# EAGLE design W5500_Ethernet_shield (EAGLE 6.5.0)

## Sheet 1 of 2
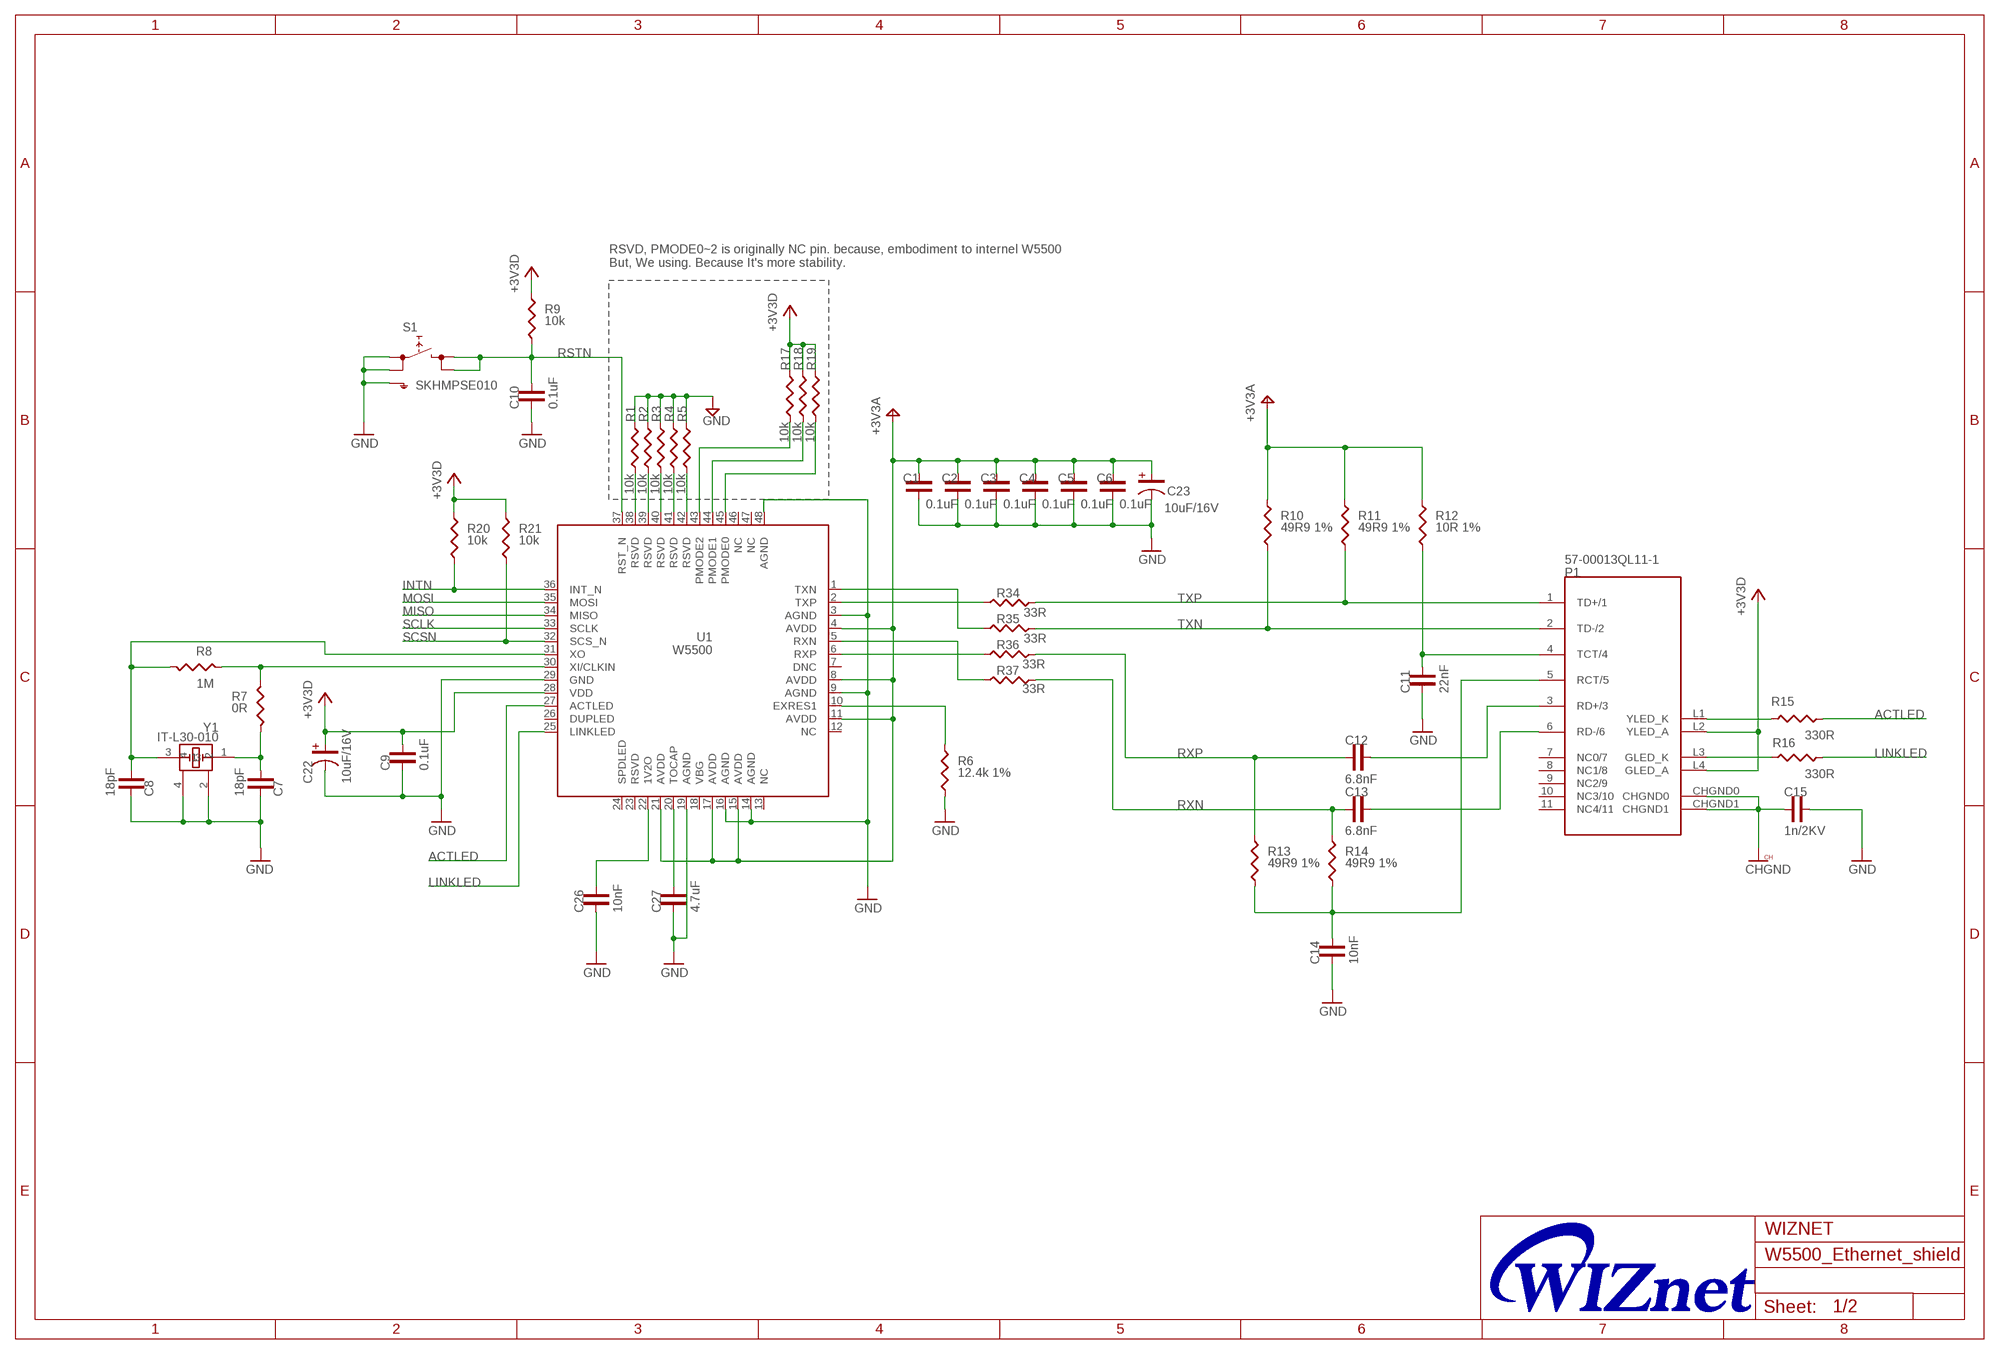
[diagram p0: schematic, sheet 1]

### Parts
C1  0.1uF  C-1608  [C-1608]
C2  0.1uF  C-1608  [C-1608]
C3  0.1uF  C-1608  [C-1608]
C4  0.1uF  C-1608  [C-1608]
C5  0.1uF  C-1608  [C-1608]
C6  0.1uF  C-1608  [C-1608]
C7  18pF  C-1608  [C-1608]
C8  18pF  C-1608  [C-1608]
C9  0.1uF  C-1608  [C-1608]
C10  0.1uF  C-1608  [C-1608]
C11  22nF  C-1608  [C-1608]
C12  6.8nF  C-1608  [C-1608]
C13  6.8nF  C-1608  [C-1608]
C14  10nF  C-1608  [C-1608]
C15  1n/2KV  C-1808  [C-1808]
C22  10uF/16V  C-3216(TANTAL)  [C-3216(TANTAL)]
C23  10uF/16V  C-3216(TANTAL)  [C-3216(TANTAL)]
C26  10nF  C-1608  [C-1608]
C27  4.7uF  C-2012  [C-2012]
P1  57-00013QL11-1  [57-00013QL11-1]
R1  10k  R-1608  [R-1608]
R2  10k  R-1608  [R-1608]
R3  10k  R-1608  [R-1608]
R4  10k  R-1608  [R-1608]
R5  10k  R-1608  [R-1608]
R6  12.4k 1%  R-1608  [R-1608]
R7  0R  R-1608  [R-1608]
R8  1M  R-1608  [R-1608]
R9  10k  R-1608  [R-1608]
R10  49R9 1%  R-1608  [R-1608]
R11  49R9 1%  R-1608  [R-1608]
R12  10R 1%  R-1608  [R-1608]
R13  49R9 1%  R-1608  [R-1608]
R14  49R9 1%  R-1608  [R-1608]
R15  330R  R-1608  [R-1608]
R16  330R  R-1608  [R-1608]
R17  10k  R-1608  [R-1608]
R18  10k  R-1608  [R-1608]
R19  10k  R-1608  [R-1608]
R20  10k  R-1608  [R-1608]
R21  10k  R-1608  [R-1608]
R34  33R  R-1608  [R-1608]
R35  33R  R-1608  [R-1608]
R36  33R  R-1608  [R-1608]
R37  33R  R-1608  [R-1608]
S1  SKHMPSE010  [SKHMPXE010]
U1  W5500  [W5500]
Y1  IT-L30-010  [IT-L30-010]

### Nets
+3V3: C9.2 C22.1 P1.L2(YLED_A) P1.L4(GLED_A) R9.2 R17.2 R18.2 R19.2 R20.2 R21.2 U1.28(VDD) ; supply symbol labelled +3V3D ; also sheet 2
+3V3A: C1.2 C2.2 C3.2 C4.2 C5.2 C6.2 C23.1 R10.2 R11.2 R12.2 U1.4(AVDD) U1.8(AVDD) U1.11(AVDD) U1.15(AVDD) U1.17(AVDD) U1.21(AVDD) ; also sheet 2
ACTLED: R15.1 U1.27(ACTLED)
CHGND: C15.P$1 P1.CHGND0 P1.CHGND1
GND: C1.1 C2.1 C3.1 C4.1 C5.1 C6.1 C7.1 C8.1 C9.1 C10.1 C11.1 C14.1 C15.P$2 C22.2 C23.2 C26.1 C27.P$1 R1.2 R2.2 R3.2 R4.2 R5.2 R6.1 S1.1(1.1) S1.2(1.2) S1.5(SH) U1.3(AGND) U1.9(AGND) U1.14(AGND) U1.16(AGND) U1.19(AGND) U1.29(GND) U1.48(AGND) Y1.2 Y1.4 ; also sheet 2
INTN: R20.1 U1.36(INT_N) ; also sheet 2
LINKLED: R16.1 U1.25(LINKLED)
MISO: U1.34(MISO) ; also sheet 2
MOSI: U1.35(MOSI) ; also sheet 2
N$1: R17.1 U1.43(PMODE2)
N$2: R18.1 U1.44(PMODE1)
N$3: R19.1 U1.45(PMODE0)
N$5: R1.1 U1.38(RSVD)
N$6: R2.1 U1.39(RSVD)
N$7: R3.1 U1.40(RSVD)
N$8: R4.1 U1.41(RSVD)
N$9: R5.1 U1.42(RSVD)
N$11: R7.2 R8.2 U1.30(XI/CLKIN)
N$12: C27.P$2 U1.20(TOCAP)
N$15: C26.2 U1.22(1V2O)
N$16: C12.2 P1.3(RD+/3)
N$17: R6.2 U1.10(EXRES1)
N$18: C13.2 P1.6(RD-/6)
N$19: C14.2 P1.5(RCT/5) R13.1 R14.1
N$20: R36.2 U1.6(RXP)
N$21: C11.2 P1.4(TCT/4) R12.1
N$22: C8.2 R8.1 U1.31(XO) Y1.3
N$24: P1.L3(GLED_K) R16.2
N$25: P1.L1(YLED_K) R15.2
N$26: R37.2 U1.5(RXN)
N$27: R34.2 U1.2(TXP)
N$28: R35.2 U1.1(TXN)
N$29: C7.2 R7.1 Y1.1
RSTN: C10.2 R9.1 S1.3(2.1) S1.4(2.2) U1.37(RST_N) ; also sheet 2
RXN: C13.1 R14.2 R37.1
RXP: C12.1 R13.2 R36.1
SCLK: U1.33(SCLK) ; also sheet 2
SCSN: R21.1 U1.32(SCS_N) ; also sheet 2
TXN: P1.2(TD-/2) R10.1 R35.1
TXP: P1.1(TD+/1) R11.1 R34.1
Unconnected: P1.7(NC0/7) P1.8(NC1/8) P1.9(NC2/9) P1.10(NC3/10) P1.11(NC4/11) U1.7(DNC) U1.12(NC) U1.13(NC) U1.18(VBG) U1.23(RSVD) U1.24(SPDLED) U1.26(DUPLED) U1.46(NC) U1.47(NC)

### Notes on the sheet
- RSVD, PMODE0~2 is originally NC pin. because, embodiment to internel W5500
  But, We using. Because It's more stability.

## Sheet 2 of 2
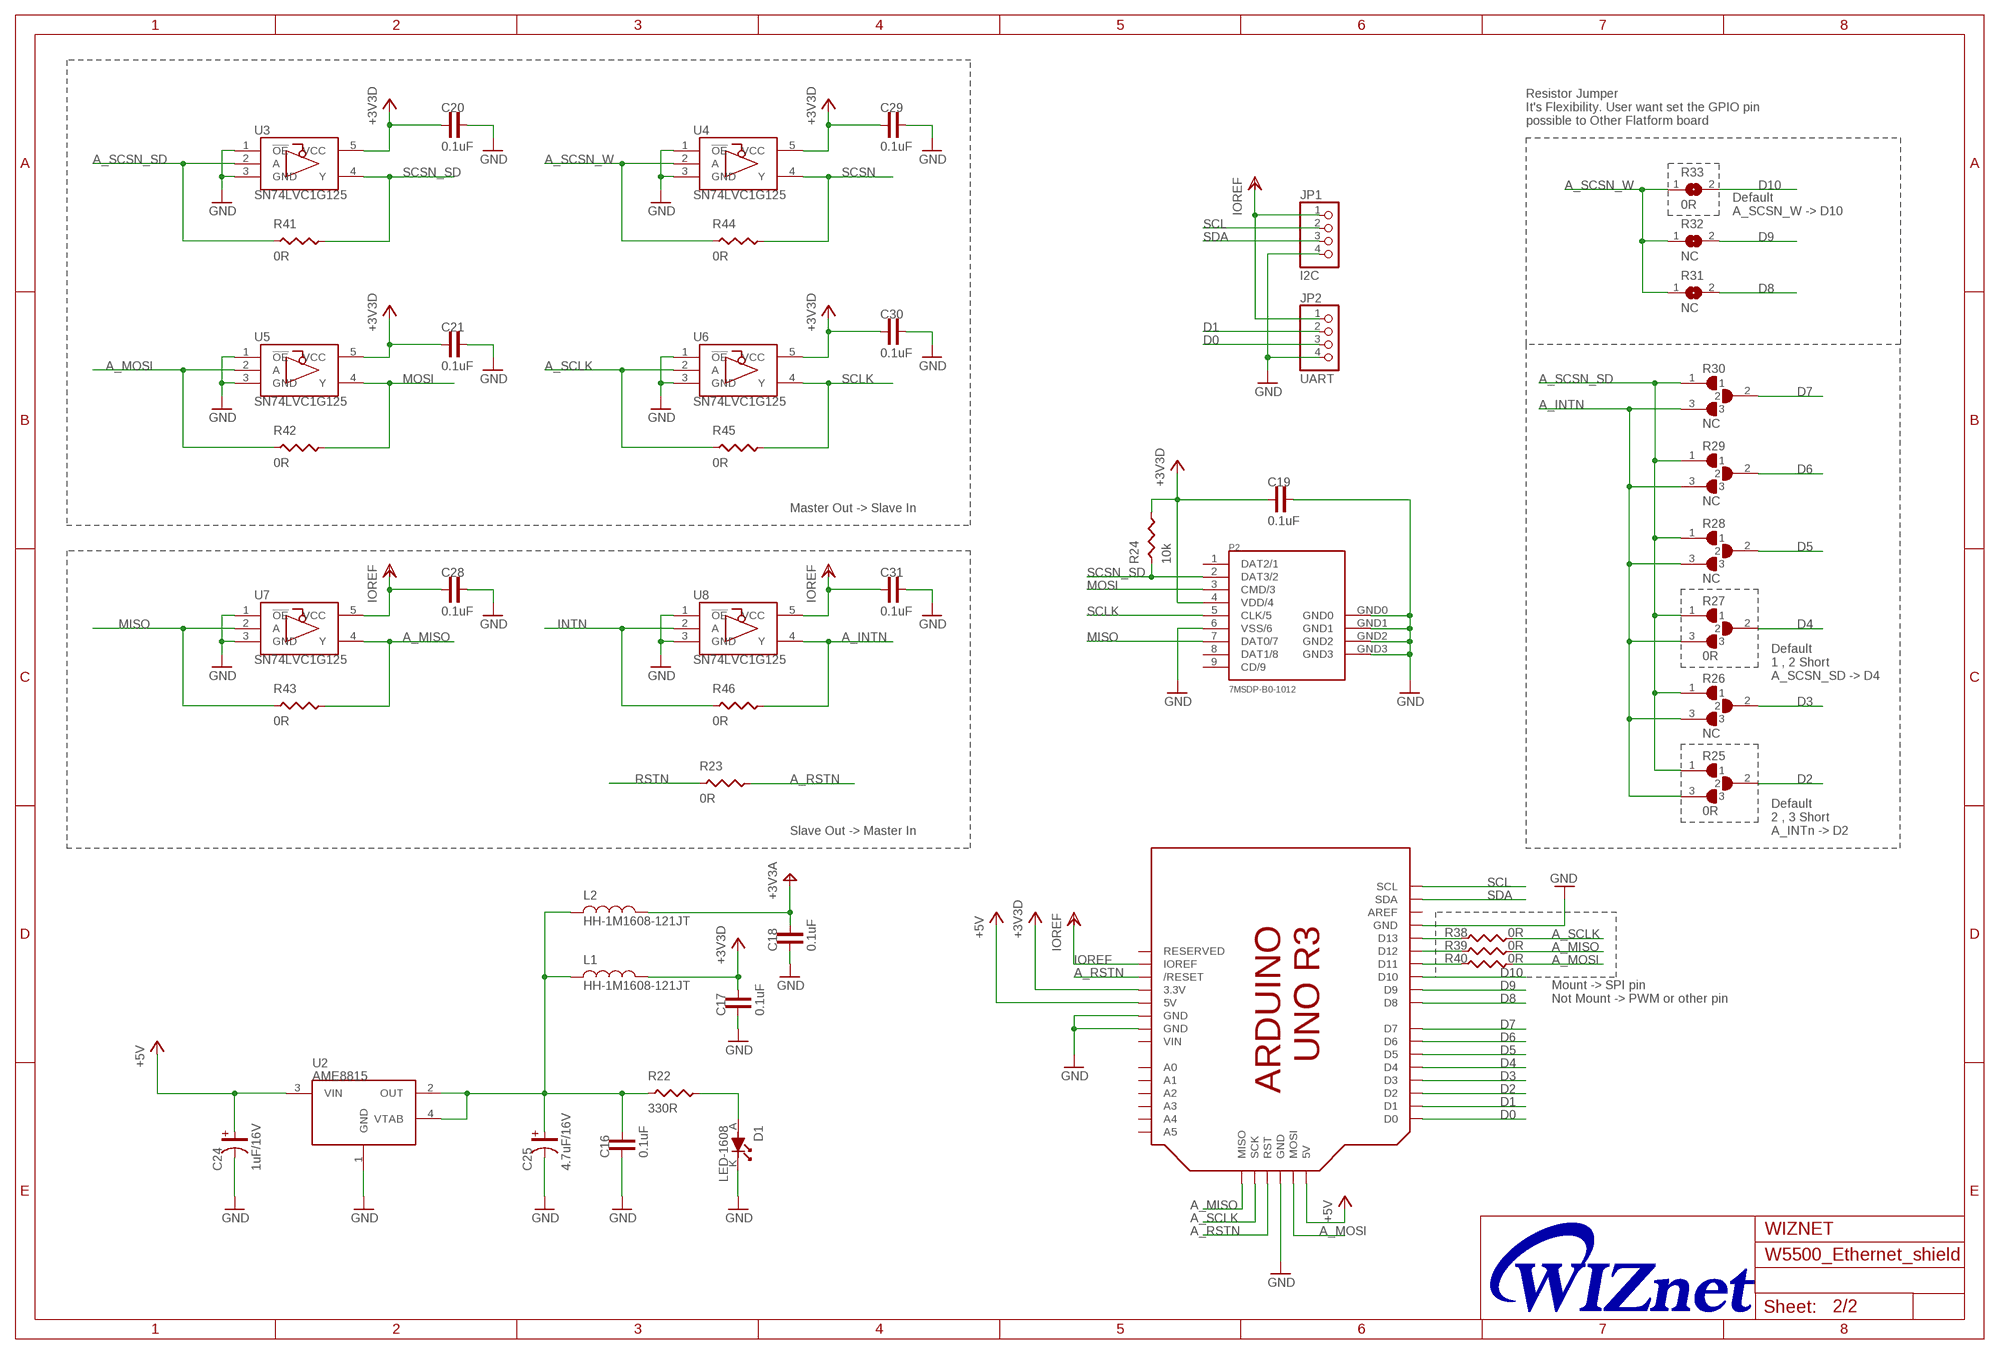
[diagram p1: schematic, sheet 2]

### Parts
C16  0.1uF  C-1608  [C-1608]
C17  0.1uF  C-1608  [C-1608]
C18  0.1uF  C-1608  [C-1608]
C19  0.1uF  C-1608  [C-1608]
C20  0.1uF  C-1608  [C-1608]
C21  0.1uF  C-1608  [C-1608]
C24  1uF/16V  C-3216(TANTAL)  [C-3216(TANTAL)]
C25  4.7uF/16V  C-3216(TANTAL)  [C-3216(TANTAL)]
C28  0.1uF  C-1608  [C-1608]
C29  0.1uF  C-1608  [C-1608]
C30  0.1uF  C-1608  [C-1608]
C31  0.1uF  C-1608  [C-1608]
D1  LED-1608  [LED-1608]
JP1  I2C  PINHD-1X4  [1X04]
JP2  UART  PINHD-1X4  [1X04]
L1  HH-1M1608-121JT  L-1608  [L-1608]
L2  HH-1M1608-121JT  L-1608  [L-1608]
P2  7MSDP-B0-1012  [7MSDP-B0-1012]
R22  330R  R-1608  [R-1608]
R23  0R  R-1608  [R-1608]
R24  10k  R-1608  [R-1608]
R25  0R  RESISTOR_JUMPER_3  [RESISTOR_JUMPER_3]
R26  NC  RESISTOR_JUMPER_3  [RESISTOR_JUMPER_3]
R27  0R  RESISTOR_JUMPER_3  [RESISTOR_JUMPER_3]
R28  NC  RESISTOR_JUMPER_3  [RESISTOR_JUMPER_3]
R29  NC  RESISTOR_JUMPER_3  [RESISTOR_JUMPER_3]
R30  NC  RESISTOR_JUMPER_3  [RESISTOR_JUMPER_3]
R31  NC  SJ_2  [SJW]
R32  NC  SJ_2  [SJW]
R33  0R  SJ_2  [SJW]
R38  0R  R-1608  [R-1608]
R39  0R  R-1608  [R-1608]
R40  0R  R-1608  [R-1608]
R41  0R  R-1608  [R-1608]
R42  0R  R-1608  [R-1608]
R43  0R  R-1608  [R-1608]
R44  0R  R-1608  [R-1608]
R45  0R  R-1608  [R-1608]
R46  0R  R-1608  [R-1608]
U2  AME8815  [AME8815]
U3  SN74LVC1G125  [SN74LVC1G125]
U4  SN74LVC1G125  [SN74LVC1G125]
U5  SN74LVC1G125  [SN74LVC1G125]
U6  SN74LVC1G125  [SN74LVC1G125]
U7  SN74LVC1G125  [SN74LVC1G125]
U8  SN74LVC1G125  [SN74LVC1G125]
U$1  ARDUINO_R3_ICSP  [ARDUINOR3_ICSP]

### Nets
+3V3: C17.2 C19.1 C20.1 C21.1 C29.1 C30.1 L1.P$2 P2.4(VDD/4) R24.2 U3.5(VCC) U4.5(VCC) U5.5(VCC) U6.5(VCC) U$1.3V(3.3V) ; supply symbol labelled +3V3D ; also sheet 1
+3V3A: C18.2 L2.P$2 ; also sheet 1
+5V: C24.1 U2.3(VIN) U$1.5V U$1.5V_ICSP(5V)
A_INTN: R25.3 R26.3 R27.3 R28.3 R29.3 R30.3 R46.2 U8.4(Y)
A_MISO: R39.2 R43.2 U7.4(Y) U$1.MISO
A_MOSI: R40.2 R42.1 U5.2(A) U$1.MOSI
A_RSTN: R23.2 U$1.RESET(/RESET) U$1.RESET_ICSP(RST)
A_SCLK: R38.2 R45.1 U6.2(A) U$1.SCK
A_SCSN_SD: R25.1 R26.1 R27.1 R28.1 R29.1 R30.1 R41.1 U3.2(A)
A_SCSN_W: R31.1 R32.1 R33.1 R44.1 U4.2(A)
D0: JP2.3 U$1.D0
D1: JP2.2 U$1.D1
D2: R25.2 U$1.D2
D3: R26.2 U$1.D3
D4: R27.2 U$1.D4
D5: R28.2 U$1.D5
D6: R29.2 U$1.D6
D7: R30.2 U$1.D7
D8: R31.2 U$1.D8
D9: R32.2 U$1.D9
D10: R33.2 U$1.D10
GND: C16.1 C17.1 C18.1 C19.2 C20.2 C21.2 C24.2 C25.2 C28.2 C29.2 C30.2 C31.2 D1.K JP1.4 JP2.4 P2.6(VSS/6) P2.GND0 P2.GND1 P2.GND2 P2.GND3 U2.1(GND) U3.1(!OE) U3.3(GND) U4.1(!OE) U4.3(GND) U5.1(!OE) U5.3(GND) U6.1(!OE) U6.3(GND) U7.1(!OE) U7.3(GND) U8.1(!OE) U8.3(GND) U$1.GND U$1.GND@1(GND) U$1.GND@2(GND) U$1.GND@3(GND) ; also sheet 1
INTN: R46.1 U8.2(A) ; also sheet 1
IOREF: C28.1 C31.1 JP1.1 JP2.1 U7.5(VCC) U8.5(VCC) U$1.IOREF
MISO: P2.7(DAT0/7) R43.1 U7.2(A) ; also sheet 1
MOSI: P2.3(CMD/3) R42.2 U5.4(Y) ; also sheet 1
N$4: D1.A R22.2
N$10: R38.1 U$1.D13
N$13: C16.2 C25.1 L1.1 L2.1 R22.1 U2.2(OUT) U2.4(VTAB)
N$14: R39.1 U$1.D12
N$30: R40.1 U$1.D11
RSTN: R23.1 ; also sheet 1
SCL: JP1.2 U$1.SCL
SCLK: P2.5(CLK/5) R45.2 U6.4(Y) ; also sheet 1
SCSN: R44.2 U4.4(Y) ; also sheet 1
SCSN_SD: P2.2(DAT3/2) R24.1 R41.2 U3.4(Y)
SDA: JP1.3 U$1.SDA
Unconnected: P2.1(DAT2/1) P2.8(DAT1/8) P2.9(CD/9) U$1.A0 U$1.A1 U$1.A2 U$1.A3 U$1.A4 U$1.A5 U$1.AREF U$1.RESERVED U$1.VIN

### Notes on the sheet
- Resistor Jumper
  It's Flexibility. User want set the GPIO pin
  possible to Other Flatform board
- Default
  A_SCSN_W -> D10
- Master Out -> Slave In
- Default
  1 , 2 Short
  A_SCSN_SD -> D4
- Slave Out -> Master In
- Default
  2 , 3 Short
  A_INTn -> D2
- Mount -> SPI pin
  Not Mount -> PWM or other pin

## Library data of the parts
C1-C14 C16-C21 C26 C28-C31 = CAP:C-1608
C15 = CAP:C-1808
C22-C25 = CAP:C-3216(TANTAL)
C27 = CAP:C-2012
D1 = DIODE:LED-1608
JP1 JP2 = pinhead_boxheader:PINHD-1X4: PIN HEADER
L1 L2 = INDUCTOR:L-1608
P1 = 57-00013QL11-1:57-00013QL11-1
P2 = 7MSDP-B0-1012:7MSDP-B0-1012
R1-R24 R34-R46 = resistor:R-1608
R25-R30 = Resistor_jumper_3:RESISTOR_JUMPER_3
R31-R33 = jumper:SJ_2
S1 = switch:SKHMP*E010: 6.2 X 6.5mm TACT Switch (SMD) Source: http://www3.alps.co.jp/WebObjects/catalog.woa/PDF/E/Switch/Tact/SKHM/SKHM.PDF
U1 = W5500:W5500
U2 = AME8815BEGT330Z:AME8815
U3-U8 = 74LVC1G125DCK:SN74LVC1G125
U$1 = Arduino_ETHERNET_modify:ARDUINO_R3_ICSP
Y1 = IT-L30-010:IT-L30-010

## Board
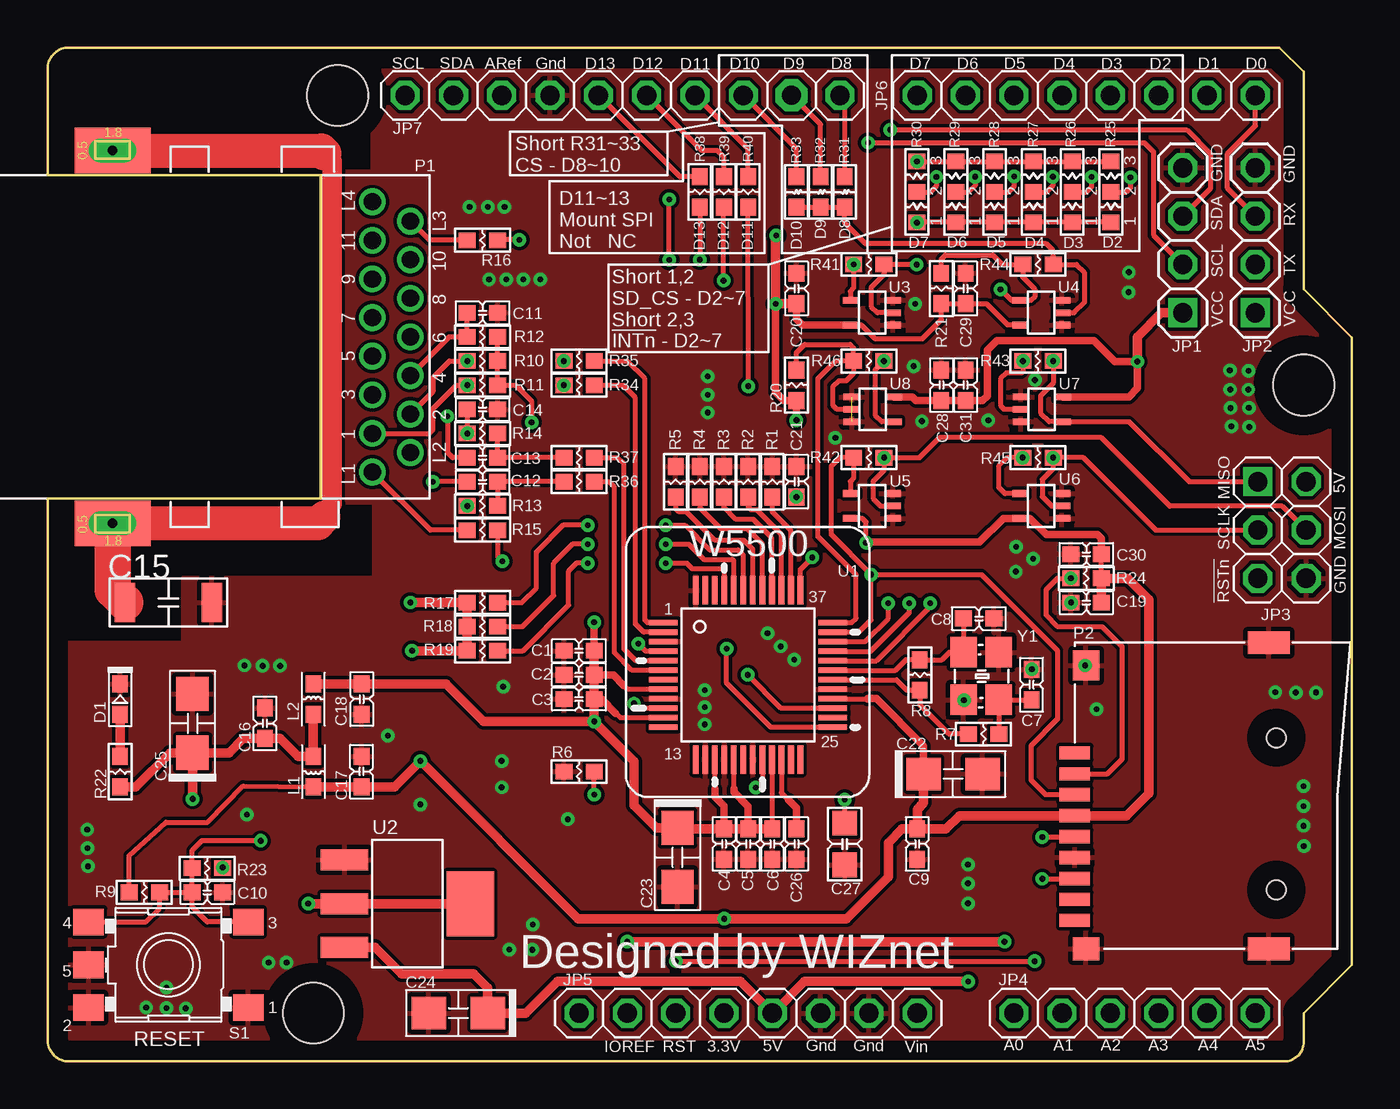
[diagram p2: board, top side]
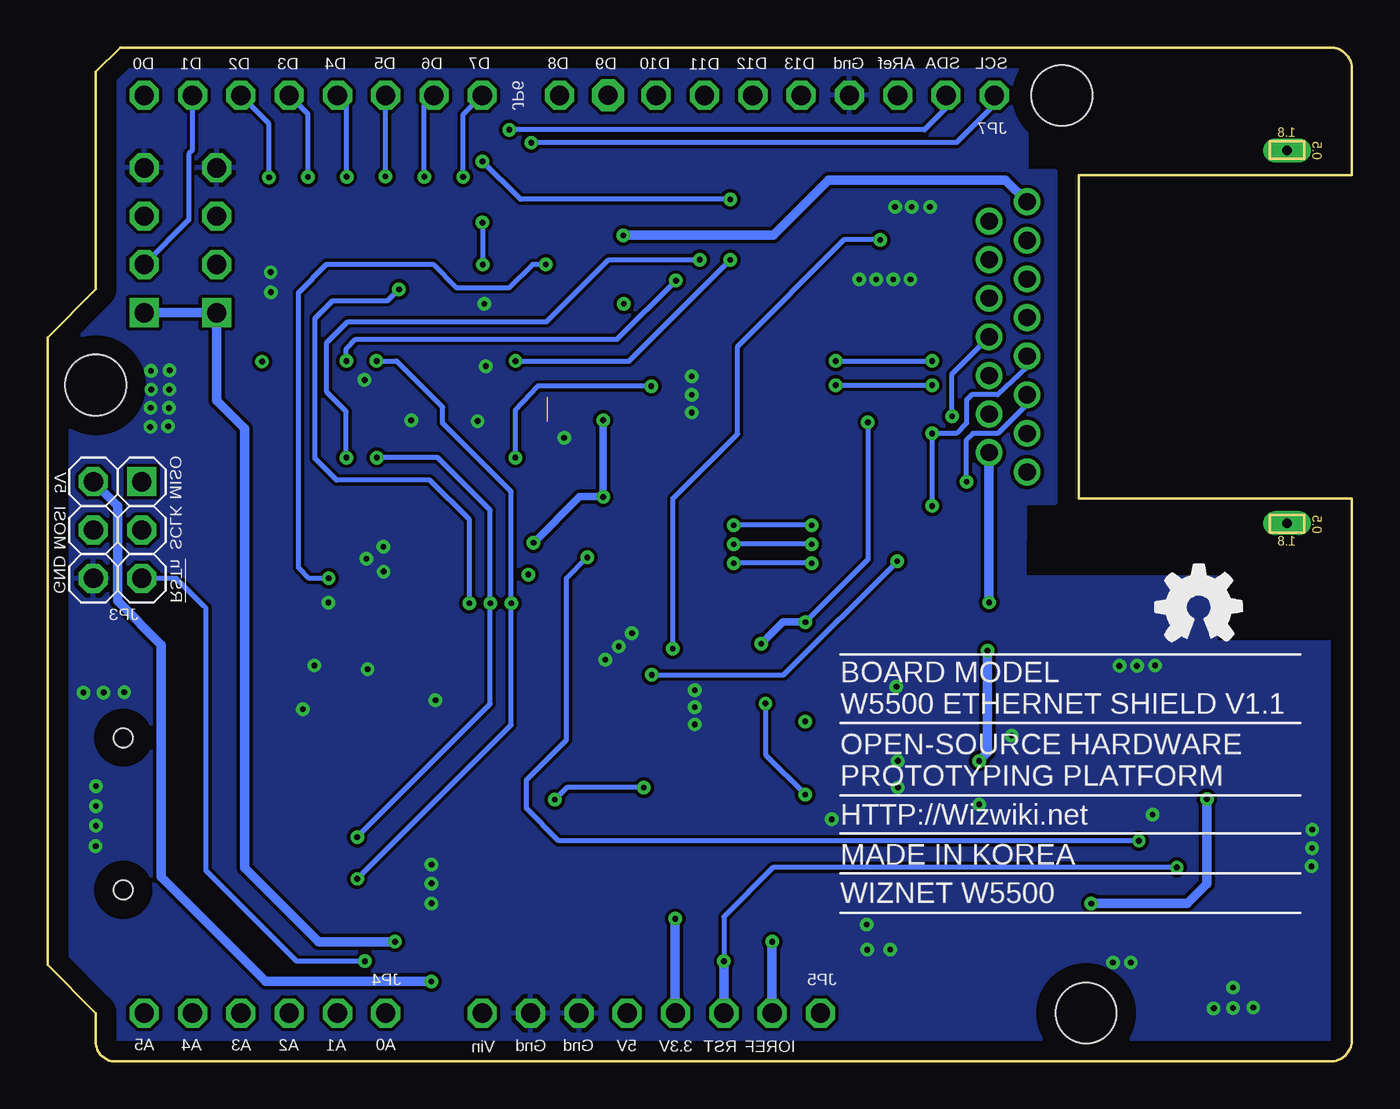
[diagram p3: board, bottom side, seen from below]

Size 68.59 x 53.31 mm. Coordinates in mm from the lower left corner, seen from the top.
Copper layers (1*16): Top 0.035mm / dielectric 1.5mm / Bottom 0.035mm
Design rules "default *": minimum track width 10mil, minimum drill 0.3mm, track to track 0.18mm, track to pad 0.18mm, pad to pad 0.18mm, via to via 0.18mm, smd to smd 0.18mm, copper to edge 40mil, drill to drill 8mil, minimum pad ring 10mil, minimum via ring 8mil, stop-mask expansion 0mil, vias tented up to drill 40mil, thermal gap 10mil

### Footprints (pad centres in the part's own frame; a part is rotated, then mirrored left to right if it is on the bottom)
C-1608 = smd 0.89 x 0.82: 1 0.8,0; 2 -0.8,0
C-1808 = smd 1.1 x 2.05: P$1 -2.285,0; P$2 2.285,0
C-3216(TANTAL) = smd 1.8 x 1.7: 1 1.55,0; 2 -1.55,0
C-2012 = smd 1.3 x 1.3: P$1 -1.1,0; P$2 1.1,0
LED-1608 = smd 0.89 x 0.82: A -0.8,0; K 0.8,0
1X04 = drill 1.016 square: 1 -3.81,0 | drill 1.016 octagon: 2 -1.27,0; 3 1.27,0; 4 3.81,0
L-1608 = smd 0.89 x 0.82: 1 -0.8,0; P$2 0.8,0
57-00013QL11-1 = drill 0.9: 1 5.075,13.66; 2 4.06,15.66; 3 3.045,13.66; 4 2.03,15.66; 5 1.015,13.66; 6 0,15.66; 7 -1.015,13.66; 8 -2.03,15.66; 9 -3.045,13.66; 10 -4.06,15.66; 11 -5.075,13.66; L1 7.105,13.66; L2 6.09,15.66; L3 -6.09,15.66; L4 -7.105,13.66 | smd 2.4 x 4: CHGND0 -9.8,0; CHGND1 9.8,0 | drill 0.5 pad 1.27 long: P$1 -9.8,0; P$2 9.8,0
7MSDP-B0-1012 = smd 0.7 x 1.6: 1 2.25,10.2; 2 1.15,10.2; 3 0.05,10.2; 4 -1.05,10.2; 5 -2.15,10.2; 6 -3.25,10.2; 7 -4.35,10.2; 8 -5.45,10.2; 9 -6.55,10.2 | smd 1.2 x 2.2: GND0 8.05,0; GND1 -8.05,0 | smd 1.6 x 1.4: GND2 6.85,9.6 | smd 1.2 x 1.4: GND3 -8.05,9.6 | hole 1: 3.05,-0.4; -4.95,-0.4
R-1608 = smd 0.89 x 0.82: 1 -0.8,0; 2 0.8,0
RESISTOR_JUMPER_3 = smd 0.82 x 0.89: 1 -1.6,0; 2 0,0; 3 1.6,0
SJW = smd 0.89 x 0.82: 1 -0.8,0; 2 0.8,0
SKHMPXE010 = smd 1.6 x 1.4: 1 -4.2,2.25; 2 4.2,2.25; 3 -4.2,-2.25; 4 4.2,-2.25; 5 4.2,0
W5500 = smd 1.5 x 0.3: 1 -4.45,2.75; 2 -4.45,2.25; 3 -4.45,1.75; 4 -4.45,1.25; 5 -4.45,0.75; 6 -4.45,0.25; 7 -4.45,-0.25; 8 -4.45,-0.75; 9 -4.45,-1.25; 10 -4.45,-1.75; 11 -4.45,-2.25; 12 -4.45,-2.75; 25 4.45,-2.75; 26 4.45,-2.25; 27 4.45,-1.75; 28 4.45,-1.25; 29 4.45,-0.75; 30 4.45,-0.25; 31 4.45,0.25; 32 4.45,0.75; 33 4.45,1.25; 34 4.45,1.75; 35 4.45,2.25; 36 4.45,2.75 | smd 0.3 x 1.5: 13 -2.75,-4.45; 14 -2.25,-4.45; 15 -1.75,-4.45; 16 -1.25,-4.45; 17 -0.75,-4.45; 18 -0.25,-4.45; 19 0.25,-4.45; 20 0.75,-4.45; 21 1.25,-4.45; 22 1.75,-4.45; 23 2.25,-4.45; 24 2.75,-4.45; 37 2.75,4.45; 38 2.25,4.45; 39 1.75,4.45; 40 1.25,4.45; 41 0.75,4.45; 42 0.25,4.45; 43 -0.25,4.45; 44 -0.75,4.45; 45 -1.25,4.45; 46 -1.75,4.45; 47 -2.25,4.45; 48 -2.75,4.45
AME8815 = smd 1.1 x 2.5: 1 -2.3,-3.175; 2 0,-3.175; 3 2.3,-3.175 | smd 3.4 x 2.5: 4 0,3.435
SN74LVC1G125 = smd 0.35 x 0.85: 1 -0.65,0; 2 0,0; 3 0.65,0; 4 0.65,2.2; 5 -0.65,2.2
ARDUINOR3_ICSP = drill 1.016 octagon: 3V 35.56,2.54; 5V 38.1,2.54; 5V_ICSP 66.167,30.48; A0 50.8,2.54; A1 53.34,2.54; A2 55.88,2.54; A3 58.42,2.54; A4 60.96,2.54; A5 63.5,2.54; AREF 23.876,50.8; D0 63.5,50.8; D1 60.96,50.8; D2 58.42,50.8; D3 55.88,50.8; D4 53.34,50.8; D5 50.8,50.8; D6 48.26,50.8; D7 45.72,50.8; D8 41.656,50.8; D10 36.576,50.8; D11 34.036,50.8; D12 31.496,50.8; D13 28.956,50.8; GND 26.416,50.8; GND@1 43.18,2.54; GND@2 40.64,2.54; GND@3 66.167,25.4; IOREF 30.48,2.54; MOSI 66.167,27.94; RESERVED 27.94,2.54; RESET 33.02,2.54; RESET_ICSP 63.627,25.4; SCK 63.627,27.94; SCL 18.796,50.8; SDA 21.336,50.8; VIN 45.72,2.54 | drill 1 pad 1.676 octagon: D9 39.116,50.8 | drill 1.016 square: MISO 63.627,30.48 | hole 3.2: 66.04,35.56; 15.24,50.8; 13.97,2.54
IT-L30-010 = smd 1.6 x 1.4: 1 -1.25,0; 2 1.25,0; 3 1.25,1.85; 4 -1.25,1.85

### Placement (x,y rotation side)
C1  27.95,21.59 180 top
C2  27.95,20.32 180 top
C3  27.95,19.05 180 top
C4  35.57,11.43 270 top
C5  36.84,11.43 270 top
C6  38.11,11.43 270 top
C7  51.74,19.81 90 top
C8  48.96,23.29 0 top
C9  45.73,11.43 270 top
C10  8.4,8.89 0 top
C11  22.87,39.37 0 top
C12  22.87,30.48 0 top
C13  22.87,31.75 0 top
C14  22.87,34.29 0 top
C15  6.36,24.13 0 top
C16  11.44,17.78 90 top
C17  16.52,15.24 90 top
C18  16.52,19.05 270 top
C19  54.62,24.13 0 top
C20  39.38,40.64 270 top
C21  39.38,30.48 270 top
C22  47.62,15.11 180 top
C23  33.13,10.73 90 top
C24  21.6,2.54 0 top
C25  7.63,17.78 270 top
C26  39.38,11.43 270 top
C27  41.92,11.43 90 top
C28  47,35.56 270 top
C29  48.27,40.64 270 top
C30  54.62,26.67 0 top
C31  48.27,35.56 270 top
D1  3.82,19.05 90 top
JP1  59.7,43.18 90 top
JP2  63.51,43.18 90 top
L1  13.98,15.24 270 top
L2  13.98,19.05 90 top
P1  3.42,38.1 270 top
P2  64.21,13.97 90 top
R1  38.11,30.48 90 top
R2  36.84,30.48 90 top
R3  35.57,30.48 90 top
R4  34.3,30.48 90 top
R5  33.03,30.48 90 top
R6  27.95,15.24 0 top
R7  49.21,17.21 180 top
R8  45.86,20.32 270 top
R9  5.09,8.89 180 top
R10  22.87,36.83 0 top
R11  22.87,35.56 0 top
R12  22.87,38.1 0 top
R13  22.87,29.21 0 top
R14  22.87,33.02 0 top
R15  22.87,27.94 180 top
R16  22.87,43.18 180 top
R17  22.87,24.13 180 top
R18  22.87,22.86 180 top
R19  22.87,21.59 180 top
R20  39.38,35.56 270 top
R21  47,40.64 270 top
R22  3.82,15.24 90 top
R23  8.4,10.16 0 top
R24  54.62,25.4 0 top
R25  55.92,45.72 90 top
R26  53.88,45.72 90 top
R27  51.84,45.72 90 top
R28  49.8,45.72 90 top
R29  47.76,45.72 90 top
R30  45.72,45.72 90 top
R31  41.92,45.72 90 top
R32  40.65,45.72 90 top
R33  39.38,45.72 90 top
R34  27.95,35.56 0 top
R35  27.95,36.83 0 top
R36  27.95,30.48 0 top
R37  27.95,31.75 0 top
R38  34.3,45.72 270 top
R39  35.57,45.72 270 top
R40  36.84,45.72 270 top
R41  43.19,41.91 180 top
R42  43.19,31.75 180 top
R43  52.08,36.83 0 top
R44  52.08,41.91 180 top
R45  52.08,31.75 180 top
R46  43.19,36.83 0 top
S1  6.36,5.08 180 top
U1  36.84,20.32 0 top
U2  18.79,8.29 270 top
U3  44.46,39.37 90 top
U4  53.35,39.37 90 top
U5  44.46,29.21 90 top
U6  53.35,29.21 90 top
U7  51.18,34.29 270 top
U8  42.29,34.29 270 top
U$1  0.01,0 0 top
U$4  [OSHP-LOGO]  11.11,21.5 0 bottom
U$7  [IOPIOT_LOGO_3]  27.21,21.8 0 bottom
Y1  50.01,20.26 90 top

### Tracks (layer width: path | path; a pad name or v marks a point on that pad's centre or on a via)
+3V3  (via drill 0.3)
  Top 0.254: R9.2 4.29,10.83 6.22,12.57 8.42,12.57 10.29,14.48 L1.P$2 | R24.2 C30.1 | v43.04,27.27 43.04,28.37 42.85,28.56 U5.5 | U3.5 42.79,38.72 43.51,38 46.01,38 47.01,39 R21.2 C29.1 49.37,39.84 50.49,38.72 U4.5 | U1.28 43.12,19.07
  Top 0.406: C30.1 55.42,27.49 55.21,27.7 52.51,27.7 51.65,28.56 U6.5 50.27,28.56 49.01,27.3 43.07,27.3 v43.04,27.27 | U3.5 39.69,38.72 39.38,39.03 C20.1 | v38.29,39.84 38.29,35.19 38.72,34.76 R20.2 v39.38,33.72 | C22.1 46.07,16.6 43.59,19.08 43.13,19.08 43.12,19.07
  Top 0.508: L1.P$2 C17.2 18.25,14.44 v19.61,15.8 27.91,7.5 v35.59,7.5 42.01,7.5 44.21,9.7 44.21,11.5 44.94,12.23 C9.2 | v19.07,24.13 R17.2 R18.2 R19.2 v19.16,21.59 | C9.2 47.25,12.23 47.94,12.92 P2.4 56.73,12.92 57.91,14.1 57.91,24.3 56.81,25.4 R24.2 C19.1 | C22.1 46.07,13.6 45.73,13.26 C9.2 | v38.32,43.44 38.29,43.41 v38.29,39.84 C20.1
  Bottom 0.406: v43.04,27.27 40.61,29.7 39.4,29.7 C21.1 v39.38,33.72
  Bottom 0.508: v38.32,43.44 30.42,43.44 27.52,46.34 18.21,46.34 P1.L4 | U$1.3V 35.59,2.54 v35.59,7.5 | v19.07,24.13 v19.08,24.14 P1.L2 | v19.61,15.8 19.16,16.24 v19.16,21.59
  other vias: 39.38,29.68
+3V3A  (via drill 0.3)
  Top 0.254: C1.2 | U1.4 31.46,21.57 v31.06,21.97 | U1.21 38.09,12.25 C6.2 | R12.2 R10.2 R11.2 24.62,35.56 25.45,34.73 v25.45,33.62 | 35.09,14.34 U1.15 | 36.09,14.33 U1.17 | U1.8 30.5,19.57 30.29,19.78 | U1.11 30.12,18.07 29.88,18.31
  Top 0.406: v28.74,23.1 C1.2 | C2.2 29.75,20.32 30.29,19.78 | C5.2 36.84,13.42 36.09,14.17 36.09,14.33 | 35.54,12.2 C4.2 35.57,13.43 35.09,13.91 35.09,14.34 | v25.45,33.62 v25.45,33.61 | C3.2 29.14,19.05 29.88,18.31
  Top 0.508: L2.P$2 C18.2 20.96,19.85 22.93,17.88 v28.74,17.88 | v28.74,17.88 30.84,15.78 30.84,13.46 32.01,12.28 C23.1 33.18,12.23 C4.2 C5.2 C6.2 | v28.74,17.88 v28.75,17.88 C3.2 C2.2 C1.2
  Bottom 0.254: v28.74,23.1 25.45,26.39 v25.45,33.61
  Bottom 0.406: v28.74,23.1 29.93,23.1 v31.06,21.97
+5V  (via drill 0.3)
  Top 0.508: U2.3 17.22,5.99 18.61,4.6 22.41,4.6 23.15,3.86 C24.1 25.15,2.54 26.81,4.2 36.45,4.2 U$1.5V 38.15,2.54 39.81,4.2 v48.41,4.2
  Bottom 0.508: v48.41,4.2 57.11,4.2 62.61,9.7 62.61,21.9 64.91,24.2 64.91,29.21 U$1.5V_ICSP
A_INTN  (via drill 0.3)
  Top 0.254: R30.3 R29.3 R28.3 R27.3 R26.3 R25.3 | v43.98,36.83 R46.2 43.52,36.36 43.52,33.99 43.87,33.64 U8.4 44.31,33.64 | v32.69,42.15 v32.69,45.33
  Bottom 0.254: v43.98,36.83 38.01,36.83 v32.69,42.15 | v32.69,45.33 43.73,45.33 R30.3
  other vias: 45.72,47.32
A_MISO  (via drill 0.3)
  Top 0.254: v35.55,41.06 35.55,44.9 R39.2 | U$1.MISO 60.03,30.48 56.87,33.64 U7.4 52.67,33.64 52.21,34.1 52.21,35 52.88,35.67 R43.2
  Bottom 0.254: R43.2 52.88,37.47 52.38,37.97 38.64,37.97 v35.55,41.06
  other vias: 52.88,36.83
A_MOSI  (via drill 0.3)
  Top 0.254: U5.2 43.81,29.2 43.41,29.6 43.41,30.5 43.99,31.08 R42.1 45.86,31.75 46.91,32.8 55.41,32.8 59.01,29.2 64.91,29.2 U$1.MOSI | v36.85,35.51 R40.2
  Bottom 0.254: R42.1 43.99,34.24 42.8,35.52 v36.85,35.51
  other vias: 43.99,31.75
A_RSTN  (via drill 0.3)
  Top 0.254: v33.02,5.27 v51.91,5.27
  Top 0.508: R23.2 v9.21,10.2
  Bottom 0.254: v9.21,10.2 30.44,10.2 33.03,7.62 v33.03,5.27 v33.02,5.27 v33.03,5.26 | U$1.RESET_ICSP 61.82,25.4 60.38,23.96 60.26,23.84 60.26,10.03 55.49,5.27 v51.91,5.27
  Bottom 0.508: U$1.RESET v33.02,5.27
A_SCLK  (via drill 0.3)
  Top 0.254: U6.2 52.81,29.2 52.31,29.7 52.31,30.6 52.88,31.17 R45.1 54.46,31.75 58.27,27.94 U$1.SCK | R38.2 v34.3,42.16
  Bottom 0.254: v34.3,42.16 39.09,42.16 42.35,38.9 52.81,38.9 53.91,37.8 53.91,35.2 52.88,34.17 R45.1
  other vias: 52.88,31.75
A_SCSN_SD  (via drill 0.3)
  Top 0.254: R25.1 R26.1 R27.1 R28.1 R29.1 R30.1 v45.72,44.11 | v45.71,41.9 R41.1 43.99,41.38 43.31,40.7 43.31,39.7 43.64,39.37 U3.2
  Bottom 0.254: v45.72,44.11 v45.71,41.9
A_SCSN_W
  Top 0.254: R33.1 R32.1 R31.1 41.91,44.1 43.01,43 52.51,43 52.88,42.63 R44.1 54.1,41.91 54.51,41.5 54.51,39.9 53.98,39.37 U4.2
ACTLED  (via drill 0.3)
  Top 0.254: R15.1 23.67,26.54 v23.91,26.3 | U1.27 38.58,18.57 v36.82,20.32
  Bottom 0.254: v36.82,20.32 29.88,20.32 v23.91,26.3
CHGND
  Top 1.016: 14.57,47.74 14.98,47.33 14.98,46.87 14.97,46.86 14.97,29.31 14.57,28.91 14.57,28.64
  Top 1.676: 14.23,28.3 14.57,28.64
  Top 1.778: P1.CHGND1 14.23,28.3 | P1.CHGND0 14.41,47.9 14.57,47.74
  Top 1.93: P1.CHGND1 3.42,24.79 C15.P$1
D0
  Top 0.254: JP2.3 62.01,45.95 62.01,47.7 63.51,49.2 U$1.D0
D1
  Bottom 0.254: JP2.2 61.16,44.26 61.16,47.73 60.97,47.92 U$1.D1
D2  (via drill 0.3)
  Top 0.254: R25.2 56.72,45.72 56.94,45.94 v56.94,46.49
  Bottom 0.254: v56.94,46.49 56.94,49.31 U$1.D2
D3  (via drill 0.3)
  Top 0.254: R26.2 54.63,45.72 54.9,45.99 v54.9,46.51
  Bottom 0.254: v54.9,46.51 54.9,49.81 U$1.D3
D4  (via drill 0.3)
  Top 0.254: R27.2 52.53,45.72 52.86,46.05 v52.86,46.52
  Bottom 0.254: v52.86,46.52 52.86,50.31 U$1.D4
D5  (via drill 0.3)
  Top 0.254: R28.2 50.53,45.72 50.82,46.01 v50.82,46.53
  Bottom 0.254: v50.82,46.53 50.81,46.61 U$1.D5
D6  (via drill 0.3)
  Top 0.254: R29.2 48.43,45.72 48.78,46.06 v48.78,46.52
  Bottom 0.254: v48.78,46.52 48.78,50.29 U$1.D6
D7  (via drill 0.3)
  Top 0.254: R30.2 46.43,45.72 46.74,46.03 v46.74,46.51
  Bottom 0.254: v46.74,46.51 46.74,49.79 U$1.D7
D8
  Top 0.254: R31.2 41.92,50.55 U$1.D8
D9
  Top 0.254: R32.2 40.65,49.28 U$1.D9
D10
  Top 0.254: R33.2 39.38,48.01 U$1.D10
GND  (via drill 0.3)  (1 unrouted)
  other vias: 53.82,24.13 51.76,20.62 48.19,18.99 50.92,25.76 51.83,26.44 50.93,27.07 49.47,33.71 45.55,36.56 54.56,20.82 55.16,18.52 37.86,22.52 39.26,21.12 38.56,21.82 34.56,18.62 34.56,17.72 34.56,19.52 23.22,41.13 24.12,41.13 25.02,41.13 25.92,41.13 45.62,39.83 41.43,32.8 51.92,35.83 6.26,2.81 7.27,2.79 6.26,3.88 5.19,2.83 17.89,17.13 19.61,13.51 10.48,12.97 11.63,5.19 12.57,5.19 25.5,5.87 25.52,7.2 24.28,5.88 2.13,10.26 2.11,11.22 2.09,12.19 10.35,20.82 11.31,20.8 12.23,20.8 34.72,34.12 34.72,35.06 34.72,36.02 22.19,44.93 23.15,44.93 24.03,44.93 45.98,33.67 56.86,41.5 62.25,33.4 62.2,34.36 63.19,33.36 63.17,34.37 63.14,35.33 62.19,35.33 62.17,36.34 63.16,36.31 56.85,40.45 48.4,10.35 48.4,9.36 48.4,8.31 66.04,14.48 66.05,13.42 66.05,12.39 66.06,11.32 64.56,19.42 65.64,19.4 66.7,19.4 23.88,14.41 23.88,15.8 27.36,12.73 23.96,19.71
  pour Bottom: -5.49,22 7.17,22 7.15,25.46 17.22,25.42 17.21,29.4 15.61,29.4 15.61,46.8 17.11,46.8 17.11,57.8 68.61,57.8 68.61,0 -5.49,0
  pour Top: -2.49,22 7.16,22 7.15,25.44 17.21,25.41 17.21,29.4 15.61,29.4 15.61,46.8 17.11,46.8 17.11,55.6 68.61,55.6 68.61,0 -2.49,0
INTN
  Top 0.254: U1.36 42.28,23.07 42.51,23.3 42.51,25.6 40.51,27.6 40.51,35.9 41.44,36.83 R46.1 | U8.2 41.52,34.29 41.31,34.5 41.31,35.5 41.61,35.8 42.01,35.8 42.39,36.18 R46.1 | R20.1 39.38,37.27 39.81,37.7 42.21,37.7 42.39,37.52 R46.1
IOREF  (via drill 0.3)
  Top 0.406: 48.31,34.8 C31.1 | C31.1 C28.1 45.65,34.76 45.47,34.94 U8.5 | C31.1 49.17,34.76 49.41,35 49.41,37.4 49.91,37.9 55.01,37.9 56.11,36.8 v57.31,36.8 57.31,35.4 56.85,34.94 U7.5
  Top 0.508: v30.48,6.29 v50.32,6.29 | JP1.1 58.58,39.37 57.31,38.1 v57.31,36.8
  Bottom 0.508: JP2.1 JP1.1 59.7,34.75 58.22,33.27 58.22,10.17 54.34,6.29 v50.32,6.29 | U$1.IOREF v30.49,6.29 v30.48,6.29
LINKLED  (via drill 0.3)
  Top 0.254: U1.25 38.04,17.57 35.71,19.9 v35.71,21.7 | v24.81,43.2 23.69,43.2 R16.1
  Bottom 0.254: v35.71,21.7 35.71,29.6 32.31,33 32.31,37.6 26.71,43.2 v24.81,43.2
MISO  (via drill 0.3)
  Top 0.254: v52.31,9.6 53.99,9.6 P2.7 | U1.34 42.98,22.07 44.21,23.3 v44.21,24.1 | v51.29,36.83 R43.1 51.28,36.27 51.21,36.2 50.41,36.2 50.11,35.9 50.11,34.5 50.32,34.29 U7.2
  Bottom 0.254: v52.31,9.6 44.21,17.7 v44.21,24.1 44.21,29.96 47.81,33.56 47.81,34.4 50.24,36.83 v51.29,36.83
MOSI  (via drill 0.3)
  Top 0.254: U1.35 42.68,22.57 43.31,23.2 v43.31,25.6 | U5.4 42.21,29.91 42.21,30.5 42.39,30.68 R42.2 41.66,31.75 41.21,31.3 41.21,27.7 v43.31,25.6 | P2.3 52.49,14.02 51.71,14.8 51.71,16.6 53.11,18 53.11,21.6 49.11,25.6 v43.31,25.6
N$1  (via drill 0.3)
  Top 0.254: U1.43 36.59,26.62 36.31,26.9 34.81,26.9 33.51,28.2 v32.51,28.2 | R17.1 24.94,24.13 25.71,24.9 25.71,26.8 27.11,28.2 v28.41,28.2
  Bottom 0.254: v28.41,28.2 v32.51,28.2
N$2  (via drill 0.3)
  Top 0.254: U1.44 36.09,26.32 36.01,26.4 34.51,26.4 33.71,27.2 v32.51,27.2 | R18.1 24.97,22.86 26.61,24.5 26.61,26.2 27.61,27.2 v28.41,27.2
  Bottom 0.254: v28.41,27.2 v32.51,27.2
N$3  (via drill 0.3)
  Top 0.254: U1.45 35.59,25.82 35.51,25.9 33.91,25.9 33.61,26.2 v32.51,26.2 | R19.1 25,21.59 27.41,24 27.41,25.8 27.81,26.2 v28.41,26.2
  Bottom 0.254: v28.41,26.2 v32.51,26.2
N$4
  Top 0.508: R22.2 D1.A
N$5
  Top 0.254: U1.38 39.09,27.92 38.11,28.9 R1.1
N$6
  Top 0.254: U1.39 38.59,27.72 37.31,29 37.01,29 36.84,29.17 R2.1
N$7
  Top 0.254: U1.40 38.09,27.52 37.11,28.5 36.21,28.5 35.57,29.14 R3.1
N$8
  Top 0.254: U1.41 37.59,27.22 36.81,28 35.41,28 34.3,29.11 R4.1
N$9
  Top 0.254: U1.42 37.09,26.92 36.61,27.4 35.11,27.4 33.61,28.9 33.21,28.9 33.03,29.08 R5.1
N$10
  Top 0.254: R38.1 33.24,46.52 U$1.D13
N$11
  Top 0.254: U1.30 44.64,20.07 45.19,19.52 R8.2 45.86,18.75 47.4,17.21 R7.2
N$12  (via drill 0.3)
  Top 0.254: v41.91,13.77 C27.P$2 | U1.20 37.59,14.75 v37.24,14.4
  Bottom 0.254: v37.24,14.4 41.28,14.4 v41.91,13.77
N$13  (via drill 0.3)
  Top 0.508: U2.4 U2.2 v13.72,8.29 v13.71,8.3 | R22.1 4.65,14.44 6.44,16.23 C25.1 | C25.1 9.54,16.23 10.29,16.98 C16.2 12.23,16.98 13.17,16.04 L1.1 L2.1 | C25.1 v7.63,13.8
  Bottom 0.508: v7.63,13.8 7.63,9.34 8.67,8.3 v13.71,8.3
N$14
  Top 0.254: R39.1 35.57,47.54 35.21,47.9 34.4,47.9 U$1.D12
N$15
  Top 0.254: C26.2 | U1.22 38.59,14.12 38.97,13.74
  Top 0.406: C26.2 39.37,13.33 38.97,13.74
N$16  (via drill 0.3)
  Top 0.254: C12.2 v20.27,30.48
  Bottom 0.254: v20.27,30.48 20.27,32.7 19.94,33.02 18.62,33.02 17.08,34.57 P1.3
N$17  (via drill 0.3)
  Top 0.254: v28.75,14.03 R6.2 | U1.10 31.09,18.57 v30.84,18.82
  Bottom 0.254: v30.84,18.82 30.84,16.12 v28.75,14.03
N$18  (via drill 0.3)
  Top 0.254: C13.2 21.31,31.75 21.03,32.03 v21.02,33.92
  Bottom 0.254: v21.02,33.92 21.03,36.15 P1.6
N$19  (via drill 0.3)
  Top 0.254: C14.2 R14.1
  Bottom 0.254: P1.5 17.08,36.52 18.62,35.06 19.99,35.06 20.27,34.78 20.27,33.56 20.81,33.02 R14.1 R13.1
  other vias: 22.07,29.21 22.07,33.02
N$20
  Top 0.254: U1.6 30.74,20.57 29.81,21.5 29.81,30.2 29.53,30.48 R36.2
N$21
  Top 0.254: P1.4 21.11,38.1 R12.1 C11.2
N$22
  Top 0.254: U1.31 44.58,20.57 45.13,21.12 R8.1 47.03,21.12 47.42,21.51 Y1.3 C8.2
N$24
  Top 0.254: R16.2 20.09,43.18 P1.L3
N$25
  Top 0.254: R15.2 20.13,27.94 P1.L1
N$26
  Top 0.254: U1.5 30.94,21.07 30.31,21.7 30.31,31.4 29.96,31.75 R37.2
N$27
  Top 0.254: U1.2 31.34,22.57 30.91,23 30.91,34.9 30.25,35.56 R34.2
N$28
  Top 0.254: U1.1 31.54,23.07 31.41,23.2 31.41,35.9 30.48,36.83 R35.2
N$29
  Top 0.254: C7.2 Y1.1 R7.1
N$30
  Top 0.254: R40.1 36.84,48.01 U$1.D11
RSTN  (via drill 0.3)
  Top 0.254: S1.4 5.16,7.33 5.89,8.06 R9.1 C10.2 | S1.3 8.4,7.33 7.6,8.13 C10.2 | C10.2 R23.1 7.6,11.09 8.11,11.6 v11.21,11.6 | U1.37 39.59,25.88 v40.21,26.5
  Bottom 0.254: v11.21,11.6 41.71,11.6 43.41,13.3 43.41,14.8 41.31,16.9 41.31,25.4 v40.21,26.5
RXN
  Top 0.254: R37.1 C13.1 R14.2
RXP
  Top 0.254: R36.1 C12.1 R13.2
SCL  (via drill 0.3)
  Top 0.254: v43.15,48.31 57.68,48.31 58.15,47.84 58.15,43.46 JP1.2
  Bottom 0.254: v43.15,48.31 42.74,48.32 20.8,48.32 18.8,50.31 U$1.SCL
SCLK  (via drill 0.3)
  Top 0.254: v52.31,11.8 53.99,11.8 P2.5 | U1.33 43.28,21.57 45.31,23.6 v45.31,24.1 | R45.2 50.46,31.75 50.01,31.3 50.01,30.2 50.35,29.86 U6.4
  Bottom 0.254: v52.31,11.8 45.31,18.8 v45.31,24.1 45.31,28.99 48.07,31.75 R45.2
  other vias: 51.28,31.75
SCSN  (via drill 0.3)
  Top 0.254: R21.1 47,42.19 47.21,42.4 49.71,42.4 50.21,41.9 R44.2 51.28,41.23 51.91,40.6 51.91,40.2 51.73,40.02 U4.4 51.13,40 50.71,40 v50.11,40.6 | U1.32 43.58,21.07 46.41,23.9 v46.41,24.1
  Bottom 0.254: v46.41,24.1 46.41,28.49 48.49,30.57 53.4,30.57 54.53,31.7 54.53,39.08 53.61,40 50.71,40 v50.11,40.6
SCSN_SD  (via drill 0.3)
  Top 0.254: P2.2 55.73,15.12 56.51,15.9 56.51,21.8 55.44,22.87 53.11,22.87 52.51,23.47 52.51,24.81 53.1,25.4 v53.81,25.4 R24.1 | R41.2 42.39,40.68 42.21,40.5 42.21,40.07 U3.4
  Bottom 0.254: v53.81,25.4 54.83,25.4 55.4,25.97 55.4,40.44 53.92,41.92 48.33,41.92 47.11,40.7 44.31,40.7 43.1,41.91 R41.2
  other vias: 42.39,41.91
SDA  (via drill 0.3)
  Top 0.254: v44.31,48.99 59.9,48.99 61.15,47.74 61.15,45.9 JP1.3
  Bottom 0.254: v44.31,48.99 22.48,48.99 21.34,50.12 U$1.SDA
TXN  (via drill 0.3)
  Top 0.254: P1.2 20.27,35.23 20.27,35.97 21.13,36.83 R10.1
  Bottom 0.254: R35.1 R10.1
  other vias: 27.15,36.83 22.07,36.83
TXP  (via drill 0.3)
  Top 0.254: P1.1 20.06,33.02 20.27,33.23 20.27,34.33 21.5,35.56 R11.1
  Bottom 0.254: R34.1 R11.1
  other vias: 27.15,35.56 22.07,35.56

### Text on the board
tPlace: JP6 | JP7 | Short R31~33 / CS - D8~10 | GND | GND | SDA | RX | D11~13 / Mount SPI / Not NC | D13 | D12 | D11 | D10 | D9 | D8 | D7 | D6 | D5 | D4 | D3 | D2 | SCL | TX | VCC | VCC | Short 1,2 / SD_CS - D2~7 / Short 2,3 / !INTn! - D2~7 | JP3 | Designed by WIZnet | JP5 | JP4 | RESET
bPlace: JP6 | JP7 | JP3 | BOARD MODEL / W5500 ETHERNET SHIELD V1.1 | OPEN-SOURCE HARDWARE / PROTOTYPING PLATFORM | HTTP://Wizwiki.net | MADE IN KOREA | WIZNET W5500 | JP5 | JP4